# Altium project PRUEBA_1.PrjPcb
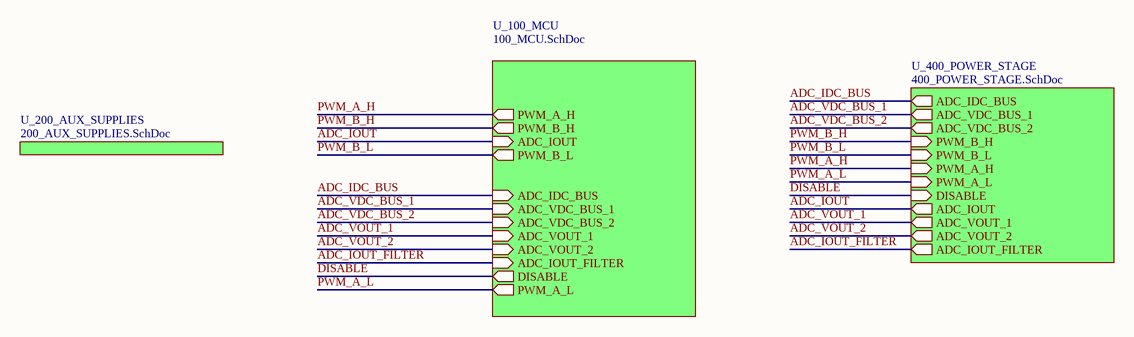
[diagram p0: 000_TOP.SchDoc]
5 sheets, 187 parts. Net scope: hierarchical (ports join the sheet entries above them; power ports are global).
Board file: PCB1.PcbDoc
Sheets:
  000_TOP.SchDoc
    U_200_AUX_SUPPLIES = 200_AUX_SUPPLIES.SchDoc
    U_400_POWER_STAGE = 400_POWER_STAGE.SchDoc
      H_BRIDGE_CORE = 410_H_BRIDGE_CORE.SchDoc
    U_100_MCU = 100_MCU.SchDoc

## Sheet 000_TOP.SchDoc
size Letter; SheetNumber: 1; SheetTotal: 5

### Sub-sheets
U_100_MCU = 100_MCU.SchDoc: PWM_A_H (out), PWM_B_H (out), ADC_IOUT (in), PWM_B_L (out), ADC_IDC_BUS (in), ADC_VDC_BUS_1 (in), ADC_VDC_BUS_2 (in), ADC_VOUT_1 (in), ADC_VOUT_2 (in), ADC_IOUT_FILTER (in), DISABLE (out), PWM_A_L (out)
U_200_AUX_SUPPLIES = 200_AUX_SUPPLIES.SchDoc: no entries
U_400_POWER_STAGE = 400_POWER_STAGE.SchDoc: ADC_IDC_BUS (out), ADC_VDC_BUS_1 (out), ADC_VDC_BUS_2 (out), PWM_B_H (in), PWM_B_L (in), PWM_A_H (in), PWM_A_L (in), DISABLE (in), ADC_IOUT (out), ADC_VOUT_1 (out), ADC_VOUT_2 (out), ADC_IOUT_FILTER (out)

### Nets
ADC_IDC_BUS: sheet U_400_POWER_STAGE/ADC_IDC_BUS, sheet U_100_MCU/ADC_IDC_BUS
ADC_IOUT: sheet U_400_POWER_STAGE/ADC_IOUT, sheet U_100_MCU/ADC_IOUT
ADC_IOUT_FILTER: sheet U_400_POWER_STAGE/ADC_IOUT_FILTER, sheet U_100_MCU/ADC_IOUT_FILTER
ADC_VDC_BUS_1: sheet U_400_POWER_STAGE/ADC_VDC_BUS_1, sheet U_100_MCU/ADC_VDC_BUS_1
ADC_VDC_BUS_2: sheet U_400_POWER_STAGE/ADC_VDC_BUS_2, sheet U_100_MCU/ADC_VDC_BUS_2
ADC_VOUT_1: sheet U_400_POWER_STAGE/ADC_VOUT_1, sheet U_100_MCU/ADC_VOUT_1
ADC_VOUT_2: sheet U_400_POWER_STAGE/ADC_VOUT_2, sheet U_100_MCU/ADC_VOUT_2
DISABLE: sheet U_400_POWER_STAGE/DISABLE, sheet U_100_MCU/DISABLE
PWM_A_H: sheet U_400_POWER_STAGE/PWM_A_H, sheet U_100_MCU/PWM_A_H
PWM_A_L: sheet U_400_POWER_STAGE/PWM_A_L, sheet U_100_MCU/PWM_A_L
PWM_B_H: sheet U_400_POWER_STAGE/PWM_B_H, sheet U_100_MCU/PWM_B_H
PWM_B_L: sheet U_400_POWER_STAGE/PWM_B_L, sheet U_100_MCU/PWM_B_L

## Sheet 200_AUX_SUPPLIES.SchDoc
size A3; SheetNumber: 3; SheetTotal: 5
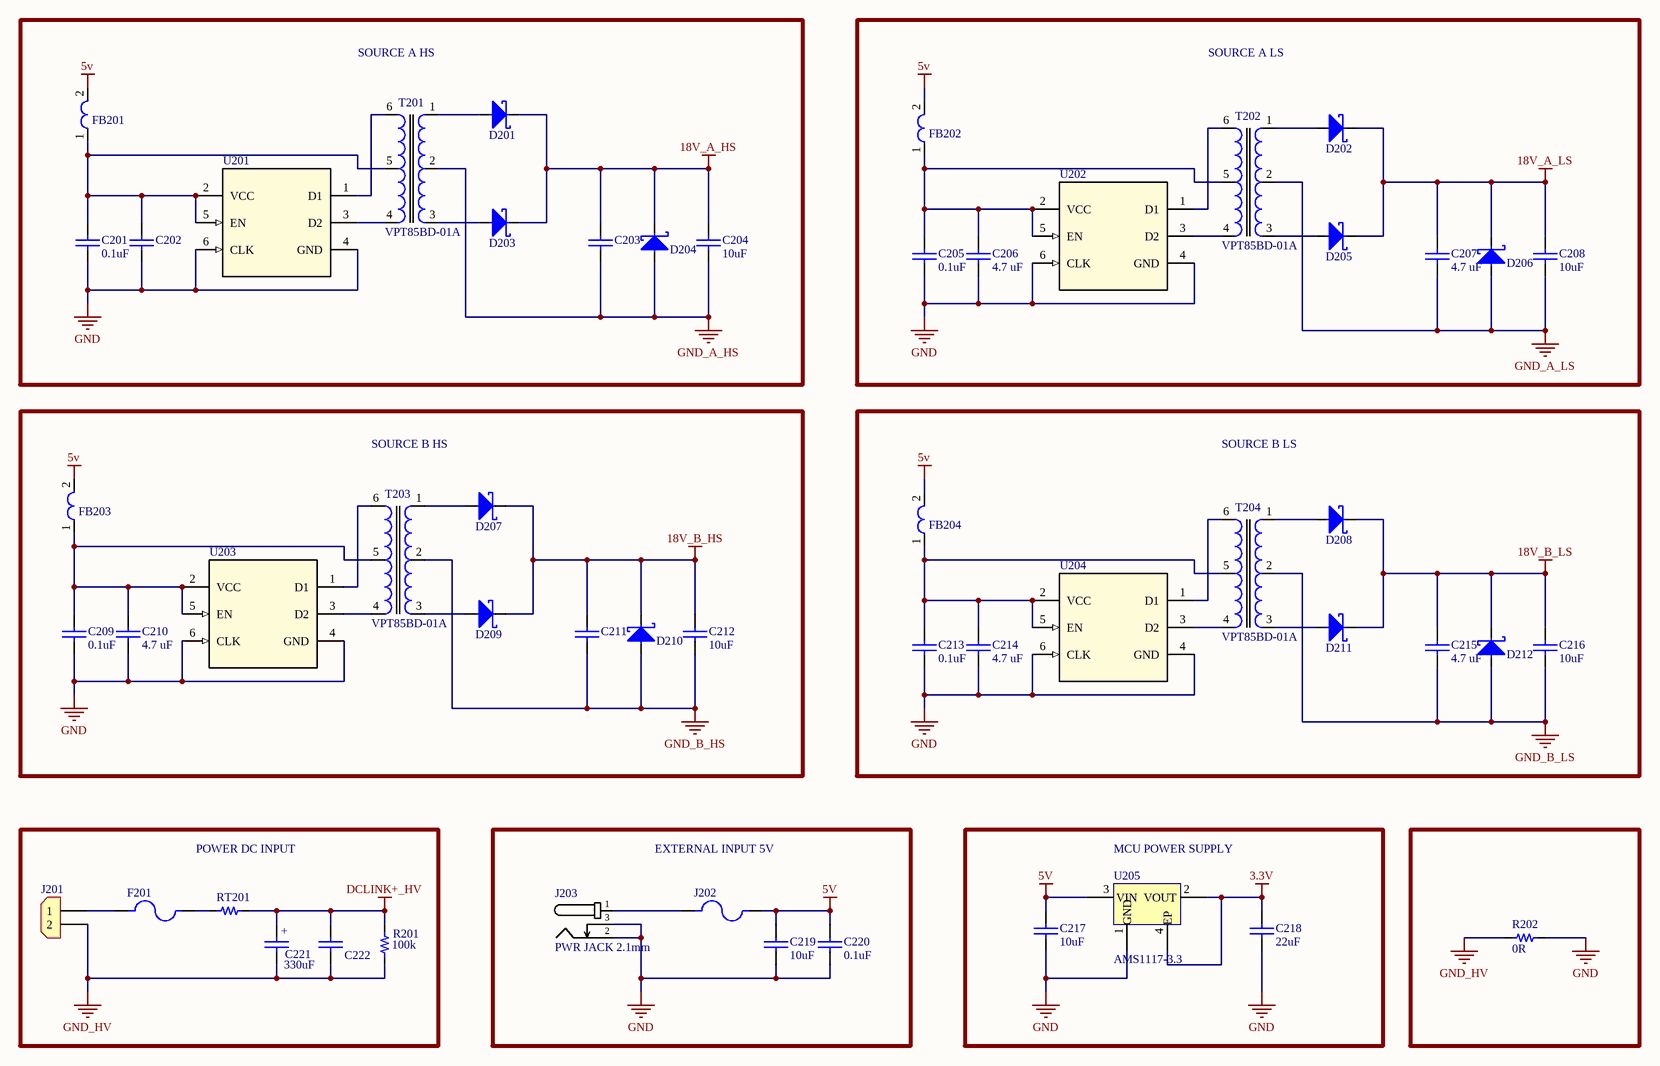
[diagram p1: 200_AUX_SUPPLIES.SchDoc]

### Parts
C201  value 0.1uF  [0603_cap]
C202  (no value)  [0603_cap]
C203  (no value)  [0603_cap]
C204  value 10uF  [0805_cap]
C205  value 0.1uF  [0603_cap]
C206  4.7 uF  [0603_cap]
C207  4.7 uF  [0603_cap]
C208  value 10uF  [0805_cap]
C209  value 0.1uF  [0603_cap]
C210  4.7 uF  [0603_cap]
C211  (no value)  [0603_cap]
C212  value 10uF  [0805_cap]
C213  value 0.1uF  [0603_cap]
C214  4.7 uF  [0603_cap]
C215  4.7 uF  [0603_cap]
C216  value 10uF  [0805_cap]
C217  value 10uF  [0603_cap]  (hidden comment: 10uF 10V)
C218  value 22uF  [0603_cap]  (hidden comment: 22uF 10V)
C219  value 10uF  [0805_cap]  (hidden comment: 10uF 25V)
C220  0.1uF  [0603_cap]
C221  value 330uF  [CAP_MXC_22x30_RUB]
C222  (no value)  [CAP_M26.5X8.5_22.5_1_KEM]
D201  30V 3A  [SMA]  (value not drawn)
D202  30V 3A  [SMA]  (value not drawn)
D203  30V 3A  [SMA]  (value not drawn)
D204  Diodo - Zener 20 V  [SOD-123_ONS]  (value not drawn)
D205  30V 3A  [SMA]  (value not drawn)
D206  Diodo - Zener 20 V  [SOD-123_ONS]  (value not drawn)
D207  30V 3A  [SMA]  (value not drawn)
D208  30V 3A  [SMA]  (value not drawn)
D209  30V 3A  [SMA]  (value not drawn)
D210  Diodo - Zener 20 V  [SOD-123_ONS]  (value not drawn)
D211  30V 3A  [SMA]  (value not drawn)
D212  Diodo - Zener 20 V  [SOD-123_ONS]  (value not drawn)
F201  (no value)  [FUSE_4628]
FB201  (no value)  [MH1608]
FB202  FERRITE_BEAD_600_OHM  [MH1608]  (value not drawn)
FB203  (no value)  [MH1608]
FB204  (no value)  [MH1608]
J201  (no value)  [CON_2x1_TH_5MM]
J202  FUSE HLDR CARTRIDGE 250V 5A PCB  [FUSE_4628]  (value not drawn)
J203  PWR JACK 2.1mm  [CON_POWER_BARREL_2.1MM_3CONN]
R201  value 100k  [YAG_FMP200_YAG]
R202  value 0R  [0603_res]  (hidden comment: 0R 1/10W)
RT201  (no value)  [RES_37S509M_TDK]
T201  Manufacturer Part Number: VPT85BD-01A  [PAD002-T764113S]  (hidden comment: TRANSFORMER_SMPS_XFMR_FWD)
T202  Manufacturer Part Number: VPT85BD-01A  [PAD002-T764113S]  (hidden comment: TRANSFORMER_SMPS_XFMR_FWD)
T203  Manufacturer Part Number: VPT85BD-01A  [PAD002-T764113S]  (hidden comment: TRANSFORMER_SMPS_XFMR_FWD)
T204  Manufacturer Part Number: VPT85BD-01A  [PAD002-T764113S]  (hidden comment: TRANSFORMER_SMPS_XFMR_FWD)
U201  (no value)  [IC TRANSFORMER DRIVER 6SOT-23]
U202  (no value)  [IC TRANSFORMER DRIVER 6SOT-23]
U203  (no value)  [IC TRANSFORMER DRIVER 6SOT-23]
U204  (no value)  [IC TRANSFORMER DRIVER 6SOT-23]
U205  AMS1117-3.3  [SOT_223]

### Blocks framed on the sheet
SOURCE A HS: C201-C204 D201 D203 D204 FB201 T201 U201
SOURCE A LS: C205-C208 D202 D205 D206 FB202 T202 U202
SOURCE B HS: C209-C212 D207 D209 D210 FB203 T203 U203
SOURCE B LS: C213-C216 D208 D211 D212 FB204 T204 U204
POWER DC INPUT: C221 C222 F201 J201 R201 RT201
EXTERNAL INPUT 5V: C219 C220 J202 J203
MCU POWER SUPPLY: C217 C218 U205

### Nets
3.3V: C218.1 U205.2(VOUT) U205.4(EP)
5v: C217.1 C219.1 C220.1 FB201.2 FB202.2 FB203.2 FB204.2 J202.2 U205.3(VIN)
18V_A_HS: C203.1 C204.1 D201.1 D203.1 D204.1
18V_A_LS: C207.1 C208.1 D202.1 D205.1 D206.1
18V_B_HS: C211.1 C212.1 D207.1 D209.1 D210.1
18V_B_LS: C215.1 C216.1 D208.1 D211.1 D212.1
DCLINK+_HV: C221.1 C222.1 R201.2 RT201.2
GND: C201.2 C202.2 C205.2 C206.2 C209.2 C210.2 C213.2 C214.2 C217.2 C218.2 C219.2 C220.2 J203.2 J203.3 R202.2 U201.4(GND) U201.6(CLK) U202.4(GND) U202.6(CLK) U203.4(GND) U203.6(CLK) U204.4(GND) U204.6(CLK) U205.1(GND)
GND_A_HS: C203.2 C204.2 D204.2 T201.2
GND_A_LS: C207.2 C208.2 D206.2 T202.2
GND_B_HS: C211.2 C212.2 D210.2 T203.2
GND_B_LS: C215.2 C216.2 D212.2 T204.2
GND_HV: C221.2 C222.2 J201.2 R201.1 R202.1
NetC201_1: C201.1 C202.1 FB201.1 T201.5 U201.2(VCC) U201.5(EN)
NetC205_1: C205.1 C206.1 FB202.1 T202.5 U202.2(VCC) U202.5(EN)
NetC209_1: C209.1 C210.1 FB203.1 T203.5 U203.2(VCC) U203.5(EN)
NetC213_1: C213.1 C214.1 FB204.1 T204.5 U204.2(VCC) U204.5(EN)
NetD201_2: D201.2 T201.1
NetD202_2: D202.2 T202.1
NetD203_2: D203.2 T201.3
NetD205_2: D205.2 T202.3
NetD207_2: D207.2 T203.1
NetD208_2: D208.2 T204.1
NetD209_2: D209.2 T203.3
NetD211_2: D211.2 T204.3
NetF201_1: F201.1 J201.1
NetF201_2: F201.2 RT201.1
NetJ202_1: J202.1 J203.1
NetT201_4: T201.4 U201.3(D2)
NetT201_6: T201.6 U201.1(D1)
NetT202_4: T202.4 U202.3(D2)
NetT202_6: T202.6 U202.1(D1)
NetT203_4: T203.4 U203.3(D2)
NetT203_6: T203.6 U203.1(D1)
NetT204_4: T204.4 U204.3(D2)
NetT204_6: T204.6 U204.1(D1)

### Notes on the sheet
- (in symbol CAP_ALUM_330UF_250V) +

### Library data of the parts
C201 C205 C209 C213 = Cap_0.1uF_0603_50V: 50V 100nF Y5V -20%~+80% 0603 Multilayer Ceramic Capacitors MLCC - SMD/SMT ROHS; Manufacturer: Walsin Tech Corp; Manufacturer Part Number: 0603F104Z500CT; Supplier 1: LCSC; Supplier Part Number 1: C83060; ComponentLink1Description: LCSC; ComponentLink1URL: https://www.lcsc.com/product-detail/Multilayer-Ceramic-Capacitors-MLCC-SMD-SMT_Walsin-Tech-Corp-0603F104Z500CT_C83060.html
C202 C203 C206 C207 C210 C211 C214 C215 = CAP_4.7UF_25V_0603: CAP CER 4.7uF 25V X5R 0603; Manufacturer: muRata; Manufacturer Part Number: GRM188R61E475KE11D; ComponentLink1Description: LCSC; ComponentLink1URL: https://www.lcsc.com/product-detail/C90057.html?s_z=n_q_GRM188R61E475KE11D&spm=wm.fly.bg.0.stp&lcsc_vid=RQNdVwAEE1JbUldTTgAIXlFWQ1NYXlYETgNXUlBVFQMxVlNRTlVXX11TRlZZXjsOAxUeFF5JWBYZEEoKFBINSQcJGk4%3D; Supplier 1: LCSC; Supplier Part Number 1: C90057
C204 C208 C212 C216 C219 = Cap_10uF_0805_25V_: 25V 10uF X5R ±10% 0805 Multilayer Ceramic Capacitors MLCC - SMD/SMT ROHS; Manufacturer: Samsung Electro-Mechanics; Manufacturer Part Number: CL21A106KAYNNNE; Supplier 1: LCSC; Supplier Part Number 1: C15850; ComponentLink1Description: LCSC; ComponentLink1URL: https://lcsc.com/product-detail/Multilayer-Ceramic-Capacitors-MLCC-SMD-SMT_Samsung-Electro-Mechanics-CL21A106KAYNNNE_C15850.html
C217 = Cap_10uF_0603_10V: 10V 10uF X5R ±10% 0603 Multilayer Ceramic Capacitors MLCC - SMD/SMT ROHS; Manufacturer: CCTC; Manufacturer Part Number: TCC0603X5R106K100CT; Supplier 1: LCSC; Supplier Part Number 1: C380314; ComponentLink1Description: LCSC; ComponentLink1URL: https://www.lcsc.com/product-detail/Multilayer-Ceramic-Capacitors-MLCC-SMD-SMT_CCTC-TCC0603X5R106K100CT_C380314.html
C218 = Cap_22uF_0603_10V: 10V 22uF X5R ±20% 0603 Multilayer Ceramic Capacitors MLCC - SMD/SMT ROHS; Manufacturer: HRE; Manufacturer Part Number: CGA0603X5R226M100JT; Supplier 1: LCSC; Supplier Part Number 1: C6119863; ComponentLink1Description: LCSC; ComponentLink1URL: https://lcsc.com/product-detail/Multilayer-Ceramic-Capacitors-MLCC-SMD-SMT_HRE-CGA0603X5R226M100JT_C6119863.html
C220 = Cap_0.1uF_0603_50V: CAP CER 100nF 50V Y5V 0603; Manufacturer: FOJAN; Manufacturer Part Number: FCC0603F104Z500CT; Supplier 1: LCSC; Supplier Part Number 1: C5137469; ComponentLink1Description: LCSC; ComponentLink1URL: https://www.lcsc.com/product-detail/C5137469.html?s_z=n_q_0603F104Z500CT&spm=wm.fly.bg.2.xh&lcsc_vid=Q1QLUFRRTgRfUVdSQAVWUgVQT1JdUlwFE1MMV1EEQgAxVlNRTlhfUFBXRlRXUTsOAxUeFF5JWBYZEEoKFBINSQcJGk4eFQsCAgIaSgADAwAHC0slTldfUldfWQkaCgg%3D; Value: 0.1uF
C221 = CAP_ALUM_330UF_250V: 330 µF 250 V Aluminum Electrolytic Capacitors Radial, Can - Snap-In 3000 Hrs @ 105°C; Manufacturer: Rubycon; Manufacturer Part Number: 250MXG330MEFCSN22X30; Supplier 1: LCSC; Supplier Part Number 1: C239294; ComponentLink1Description: LCSC; ComponentLink1URL: https://www.lcsc.com/product-detail/C239294.html?s_z=n_q_250MXG330MEFCSN22X30
C222 = CAP FILM 1UF 10% 400VDC RADIAL: 1 µF Film Capacitor 200V 400V Polyester, Polyethylene Terephthalate (PET), Metallized Radial; Manufacturer: KEMET; Manufacturer Part Number: R60MN4100AA40K; Supplier 1: LCSC; Supplier Part Number 1: C3775208; ComponentLink1Description: LCSC; ComponentLink1URL: https://www.lcsc.com/product-detail/C3775208.html?s_z=n_q_R60MN4100AA40K&spm=wm.fly.bg.0.xh&lcsc_vid=Q1QLUFRRTgRfUVdSQAVWUgVQT1JdUlwFE1MMV1EEQgAxVlNRTlZbUlJXT1VWXjsOAxUeFF5JWBYZEEoKFBINSQcJGk4eFQsCAgIaSgADAwAHC0slRVhXUFVQR08GEwkK
D201-D203 D205 D207-D209 D211 = D_Schottky_40V_3A_SMA: 40V Independent 3A 550mV@3A SMA Schottky Diodes ROHS; Manufacturer: TDSEMIC; Manufacturer Part Number: SS34-TD; Supplier 1: LCSC; Supplier Part Number 1: C46550832; ComponentLink1Description: LCSC; ComponentLink1URL: https://lcsc.com/product-detail/Schottky-Diodes_TDSEMIC-SS34-TD_C46550832.html
D204 D206 D210 D212 = Diodo - Zener 20 V: -55℃~+150℃ 1 Independent 100nA@15V 19V~21V 20V 25Ω 500mW 600Ω SOD-123 Zener Diodes ROHS; Manufacturer: Slkor(SLKORMICRO Elec.); Manufacturer Part Number: MMSZ5250B; Supplier 1: JLCPCB; Supplier Part Number 1: C707177; ComponentLink1Description: JLCPCB; ComponentLink1URL: https://jlcpcb.com/partdetail/Slkor_SLKORMICRO_Elec-MMSZ5250B/C707177
F201 J202 = FUSE HLDR CARTRIDGE 250V 5A PCB: Fuse Holder 5 A 250V 1 Circuit Cartridge Through Hole; Manufacturer: Keystone; Manufacturer Part Number: 4628; Supplier 1: LCSC; Supplier Part Number 1: C3205254; ComponentLink1Description: LCSC; ComponentLink1URL: https://www.lcsc.com/product-detail/C3205254.html?s_z=n_q_x_Keystone%25204628&spm=wm.ssy.em.0.tz&lcsc_vid=Q1QLUFRRTgRfUVdSQAVWUgVQT1JdUlwFE1MMV1EEQgAxVlNRTlZbVlFQQVlcXzsOAxUeFF5JWBYZEEoKFBINSQcJGk4eFQsCAgIaSgADAwAHC0slQ1hXVFRQQU8GEwkK
FB201-FB204 = FERRITE_BEAD_600_OHM: FERRITE BEAD 600 OHM 0603 4LN; Manufacturer: Bourns Inc.; Manufacturer Part Number: MH1608-601Y; ComponentLink1Description: DigiKEy; ComponentLink1URL: https://www.digikey.com/en/products/detail/bourns-inc/MH1608-601Y/2563317; Supplier 1: DigiKey; Supplier Part Number 1: MH1608-601YCT-ND
J201 = Con_2x1_TH_5mm: 2POS 5MM; Manufacturer: JILN; Manufacturer Part Number: JL126-50002G01; Supplier 1: LCSC; Supplier Part Number 1: C394556; ComponentLink1Description: Digi-Key; ComponentLink1URL: https://www.lcsc.com/product-detail/Screw-terminal_JILN-JL126-50002G01_C394556.html
J203 = Con_Power_Jack_2.1mm_3pins: CONN PWR JACK 2X5.5MM SOLDER; Manufacturer: HCTL; Manufacturer Part Number: HC-DC-005-2.0T; Supplier 1: LCSC; Supplier Part Number 1: C3010533; ComponentLink1Description: LCSC; ComponentLink1URL: https://www.lcsc.com/product-detail/AC-DC-Power-Connectors_HCTL-HC-DC-005-2-0T_C3010533.html
R201 = RES 100K OHM 5% 2W AXIAL: 100 kOhms ±5% 2W Through Hole Resistor Axial Flame Proof, Safety Metal Film; Manufacturer: YAGEO; Manufacturer Part Number: FMP200JR-52-100K; ComponentLink1URL: https://www.lcsc.com/product-detail/C3456483.html?s_z=n_q_FMP200JR-52-100K&spm=wm.fly.bg.0.xh&lcsc_vid=Q1QLUFRRTgRfUVdSQAVWUgVQT1JdUlwFE1MMV1EEQgAxVlNRTlZbUVVUQFBeVjsOAxUeFF5JWBYZEEoKFBINSQcJGk4eFQsCAgIaSgADAwAHC0slRFZZUlZWT08GEwkK; Supplier 1: LCSC; Supplier Part Number 1: C3456483; ComponentLink1Description: LCSC
R202 = Res_0R_0603_1/10W: RES SMD 0R OHM 5% 1/10W 0603; Manufacturer: FOJAN; Manufacturer Part Number: FRC0603P000 TS; ComponentLink1URL: https://www.lcsc.com/product-detail/Chip-Resistor-Surface-Mount_FOJAN-FRC0603P000-TS_C2907080.html; Supplier 1: LCSC; Supplier Part Number 1: C2907080; ComponentLink1Description: LCSC
RT201 = ICL_5_OHM_5A: Inrush Current Limiter 5 Ohms ±20% 5 A 0.591" (15.00mm); Manufacturer: TDK; Manufacturer Part Number: B57237S0509M000; ComponentLink1URL: https://www.lcsc.com/product-detail/C718537.html?s_z=n_q_B57237S0509M000&spm=wm.fly.bg.0.xh&lcsc_vid=FQVeX1BfQFIKVFVWE1NbBlcHQlcKVgFUQwMPAQZWElcxVlNRTlldUVVTT1FbVjsOAxUeFF5JWBYZEEoKFBINSQcJGk4eFQsCAgIaSgADAwAHC0slRFVbUVBeRE8GEwkK; Supplier 1: LCSC; Supplier Part Number 1: C718537; ComponentLink1Description: LCSC
T201-T204 = TRANSFORMER_SMPS_XFMR_FWD: XFMR FWD P-P DC/DC CONV 475UH SM; Manufacturer: VPSC; ComponentLink1Description: LCSC; ComponentLink1URL: https://www.lcsc.com/product-detail/C2846911.html; Supplier 1: LCSC; Supplier Part Number 1: C2846911
U201-U204 = IC_TRANSFORMER_DRIVER_6SOT-23: IC TRANSFORMER DRIVER 6SOT-23; Manufacturer Part Number: SN6505BDBVR; Manufacturer: Texas Instruments; ComponentLink1Description: LCSC; ComponentLink1URL: https://www.lcsc.com/product-detail/C74518.html?s_z=n_q_SN6505BDBVR&spm=wm.fly.bg.0.xh&lcsc_vid=RQNdVwAEE1JbUldTTgAIXlFWQ1NYXlYETgNXUlBVFQMxVlNRTlReV1VfRFJbUjsOAxUeFF5JWBYZEEoKFBINSQcJGk4eFQsCAgIaSgADAwAHC0slTlFeUlNIHxUDCw%3D%3D; Supplier 1: LCSC; Supplier Part Number 1: C74518
U205 = LDO_3V3_1A_FIXED: 1A 60dB@(120Hz) Fixed 3.3V Positive 18V SOT-223 Linear Voltage Regulators (LDO) ROHS; Manufacturer: UMW(Youtai Semiconductor Co., Ltd.); ComponentLink1Description: LCSC; ComponentLink1URL: https://www.lcsc.com/product-detail/_UMW-Youtai-Semiconductor-Co-Ltd-_C347222.html; Supplier 1: LCSC; Manufacturer Part Number: AMS1117-3.3; Supplier Part Number 1: C347222

## Sheet 400_POWER_STAGE.SchDoc
size A2; SheetNumber: 4; SheetTotal: 5
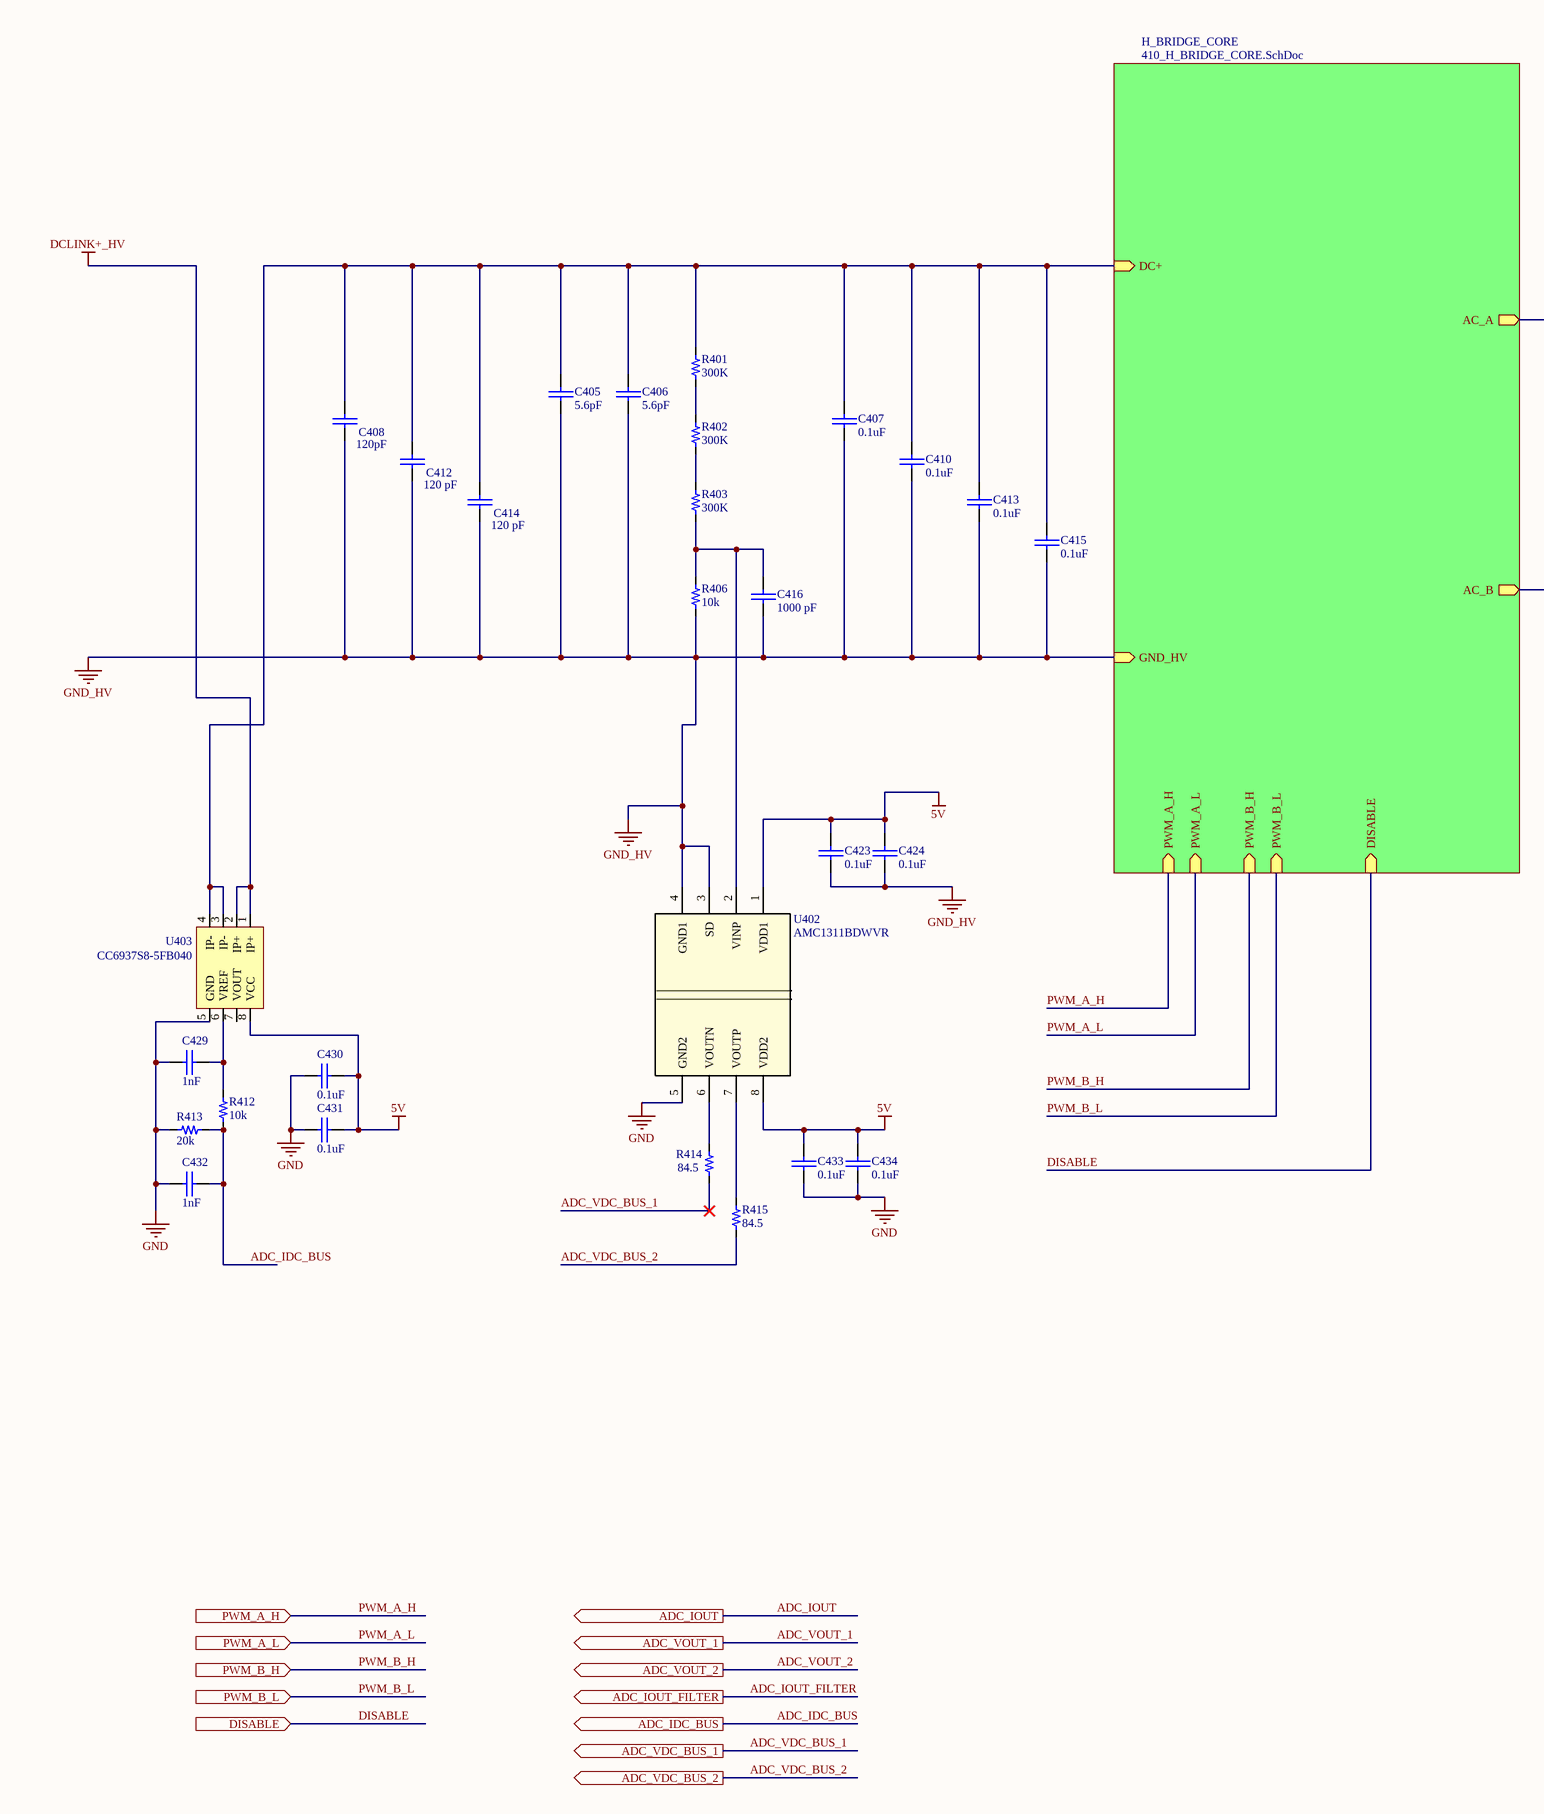
[diagram p2: 400_POWER_STAGE.SchDoc, left]
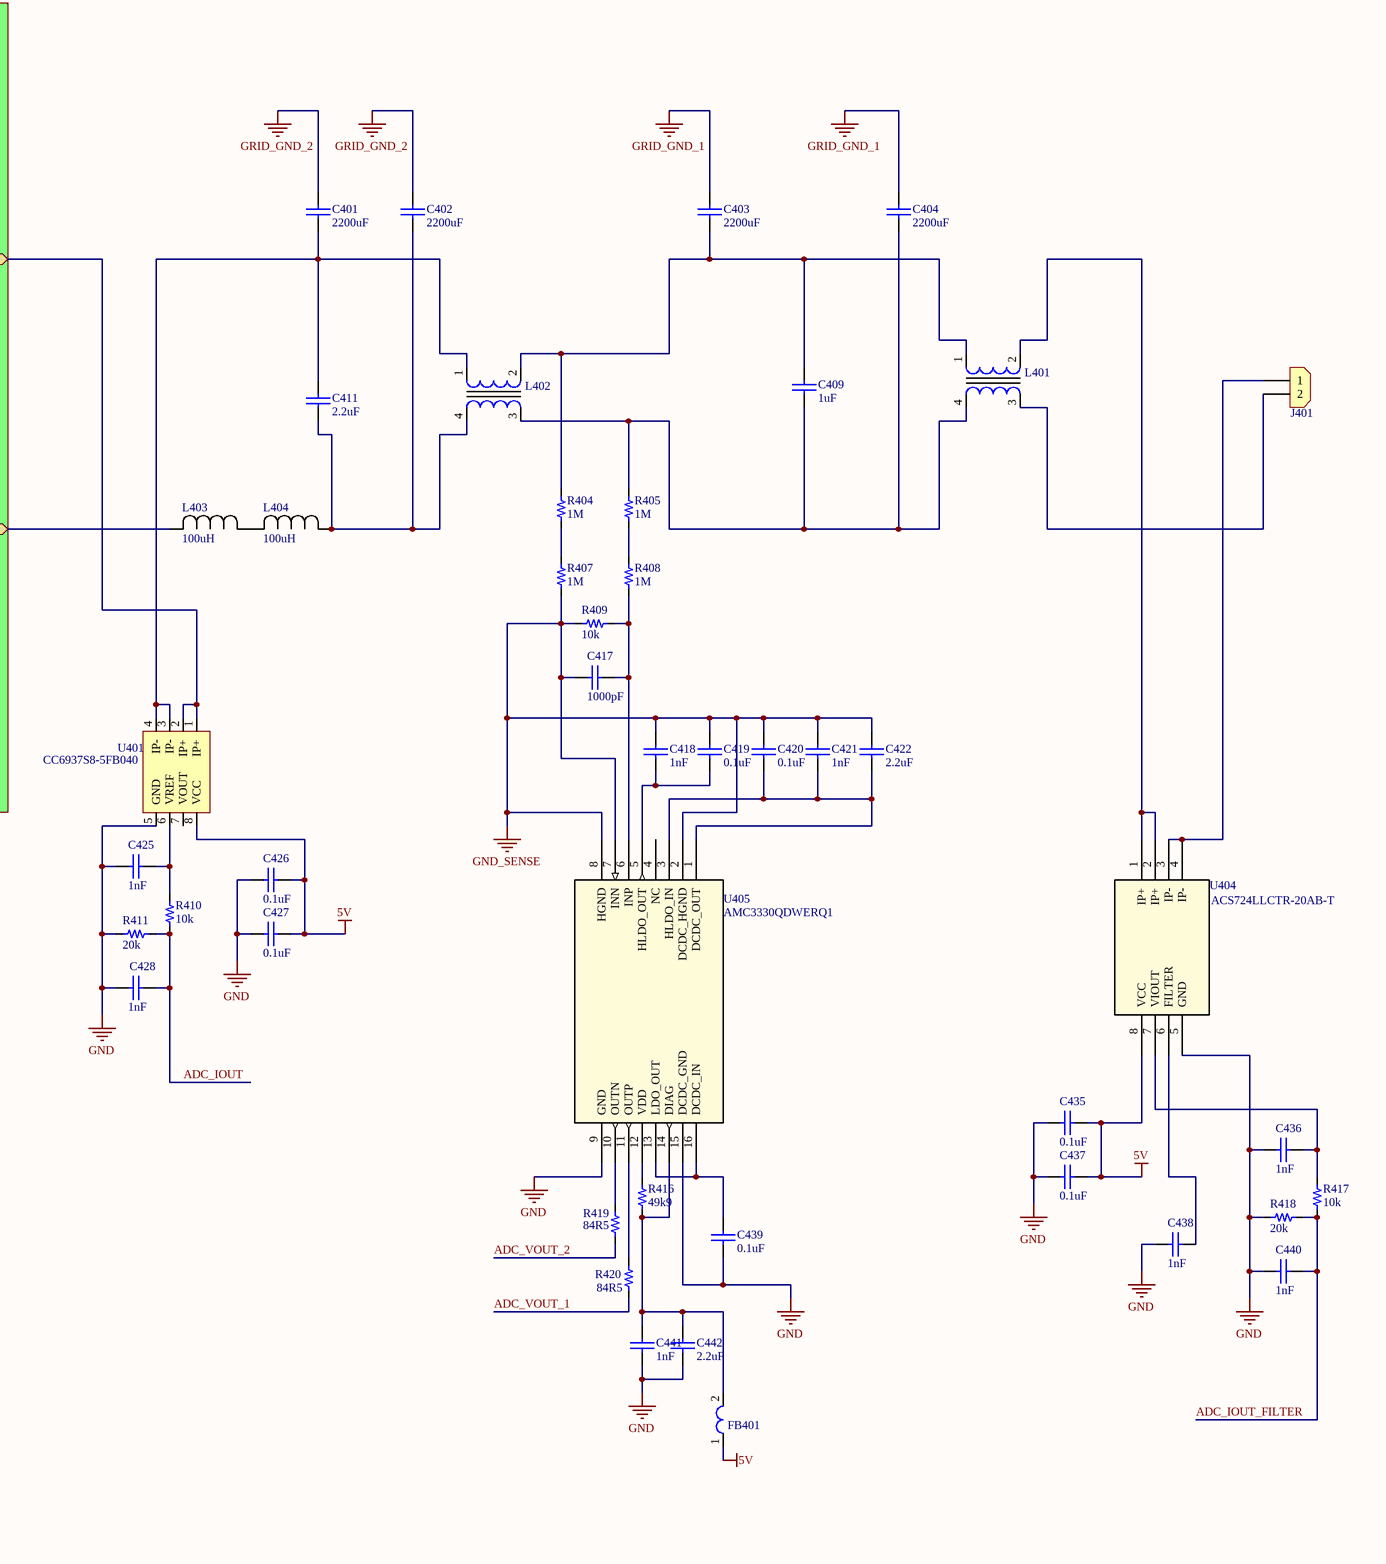
[diagram p3: 400_POWER_STAGE.SchDoc, right]

### Parts
C401  2200uF  [Through Hole,P=7.5mm]
C402  2200uF  [Through Hole,P=7.5mm]
C403  2200uF  [Through Hole,P=7.5mm]
C404  2200uF  [Through Hole,P=7.5mm]
C405  value 5.6pF  [0603_cap]  (hidden comment: 2.2uF)
C406  value 5.6pF  [0603_cap]  (hidden comment: 2.2uF)
C407  0.1uF  [0603_cap]
C408  120pF  [0603_cap]
C409  value 1uF  [CAP_2220]  (hidden comment: 1uF 50V)
C410  0.1uF  [0603_cap]
C411  value 2.2uF  [CAP_2220]
C412  120 pF  [0603_cap]
C413  0.1uF  [0603_cap]
C414  120 pF  [0603_cap]
C415  0.1uF  [0603_cap]
C416  1000 pF  [0603_cap]
C417  value 1000pF  [0603_cap]
C418  value 1nF  [0603_cap]
C419  0.1uF  [0603_cap]
C420  0.1uF  [0603_cap]
C421  value 1nF  [0603_cap]
C422  value 2.2uF  [0603_cap]
C423  0.1uF  [0603_cap]
C424  0.1uF  [0603_cap]
C425  value 1nF  [0603_cap]
C426  0.1uF  [0603_cap]
C427  0.1uF  [0603_cap]
C428  value 1nF  [0603_cap]
C429  value 1nF  [0603_cap]
C430  0.1uF  [0603_cap]
C431  0.1uF  [0603_cap]
C432  value 1nF  [0603_cap]
C433  0.1uF  [0603_cap]
C434  0.1uF  [0603_cap]
C435  0.1uF  [0603_cap]
C436  value 1nF  [0603_cap]
C437  0.1uF  [0603_cap]
C438  value 1nF  [0603_cap]
C439  0.1uF  [0603_cap]
C440  value 1nF  [0603_cap]
C441  value 1nF  [0603_cap]
C442  value 2.2uF  [0603_cap]
FB401  (no value)  [MH1608]
J401  (no value)  [CON_2x1_TH_5MM]
L401  (no value)  [PH9455405NL]
L402  (no value)  [PH9455405NL]
L403  value 100uH  [IND-SMD_L13.7-W12.8_FCH1365]  (hidden comment: 200uH)
L404  value 100uH  [IND-SMD_L13.7-W12.8_FCH1365]  (hidden comment: 200uH)
R401  300K  [0603_res]
R402  300K  [0603_res]
R403  300K  [0603_res]
R404  value 1M  [0603_res]
R405  value 1M  [0603_res]
R406  value 10k  [0603_res]
R407  value 1M  [0603_res]
R408  value 1M  [0603_res]
R409  value 10k  [0603_res]
R410  value 10k  [0603_res]
R411  20k  [0603_res]
R412  value 10k  [0603_res]
R413  20k  [0603_res]
R414  value 84.5  [0603_res]
R415  value 84.5  [0603_res]
R416  value 49k9  [0603_res]
R417  value 10k  [0603_res]
R418  20k  [0603_res]
R419  value 84R5  [0603_res]
R420  value 84R5  [0603_res]
U401  Manufacturer Part Number: CC6937S8-5FB040  [SOP-8_L4.9]
U402  AMC1311BDWVR  [DWV0008A]
U403  Manufacturer Part Number: CC6937S8-5FB040  [SOP-8_L4.9]
U404  Manufacturer Part Number: ACS724LLCTR-20AB-T  [SOICN8_LC_ALM]
U405  AMC3330QDWERQ1  [SOIC16_DWE_TEX]

### Sub-sheets
H_BRIDGE_CORE = 410_H_BRIDGE_CORE.SchDoc: PWM_A_H (in), PWM_A_L (in), PWM_B_H (in), PWM_B_L (in), DC+ (in), GND_HV (in), DISABLE (in), AC_A (out), AC_B (out)

### Ports
ADC_IDC_BUS (out), ADC_IOUT (out), ADC_IOUT_FILTER (out), ADC_VDC_BUS_1 (out), ADC_VDC_BUS_2 (out), ADC_VOUT_1 (out), ADC_VOUT_2 (out), DISABLE (in), PWM_A_H (in), PWM_A_L (in), PWM_B_H (in), PWM_B_L (in)

### Nets
5v: C423.1 C424.1 C426.2 C427.2 C430.2 C431.2 C433.1 C434.1 C435.2 C437.2 FB401.1 U401.8(VCC) U402.1(VDD1) U402.8(VDD2) U403.8(VCC) U404.8(VCC)
DCLINK+_HV: U403.1(IP+) U403.2(IP+)
GND: C425.2 C426.1 C427.1 C428.1 C429.2 C430.1 C431.1 C432.1 C433.2 C434.2 C435.1 C436.2 C437.1 C438.2 C439.2 C440.1 C441.2 C442.2 R411.1 R413.1 R418.1 U401.5(GND) U402.5(GND2) U403.5(GND) U404.5(GND) U405.9(GND) U405.15(DCDC_GND)
GND_HV: C405.2 C406.2 C407.2 C408.2 C410.2 C412.2 C413.2 C414.2 C415.2 C416.2 C423.2 C424.2 R406.1 U402.3(SD) U402.4(GND1) ; sheet H_BRIDGE_CORE/GND_HV
GND_SENSE: C417.1 C418.1 C419.1 C420.1 C421.1 C422.1 R407.1 R409.1 U405.2(DCDC_HGND) U405.7(INN) U405.8(HGND)
GRID_GND_1: C403.1 C404.1
GRID_GND_2: C401.1 C402.1
AC_A: U401.1(IP+) U401.2(IP+) ; sheet H_BRIDGE_CORE/AC_A
AC_B: L403.2 ; sheet H_BRIDGE_CORE/AC_B
ADC_IDC_BUS: C432.2 R412.1 R413.2 ; port ADC_IDC_BUS
ADC_IOUT: C428.2 R410.1 R411.2 ; port ADC_IOUT
ADC_IOUT_FILTER: C440.2 R417.1 R418.2 ; port ADC_IOUT_FILTER
ADC_VDC_BUS_1: R414.1 ; port ADC_VDC_BUS_1
ADC_VDC_BUS_2: R415.1 ; port ADC_VDC_BUS_2
ADC_VOUT_1: R420.1 ; port ADC_VOUT_1
ADC_VOUT_2: R419.1 ; port ADC_VOUT_2
DC+: C405.1 C406.1 C407.1 C408.1 C410.1 C412.1 C413.1 C414.1 C415.1 R401.2 U403.3(IP-) U403.4(IP-) ; sheet H_BRIDGE_CORE/DC+
DISABLE: port DISABLE, sheet H_BRIDGE_CORE/DISABLE
PWM_A_H: port PWM_A_H, sheet H_BRIDGE_CORE/PWM_A_H
PWM_A_L: port PWM_A_L, sheet H_BRIDGE_CORE/PWM_A_L
PWM_B_H: port PWM_B_H, sheet H_BRIDGE_CORE/PWM_B_H
PWM_B_L: port PWM_B_L, sheet H_BRIDGE_CORE/PWM_B_L
NetC401_2: C401.2 C411.2 L402.1 U401.3(IP-) U401.4(IP-)
NetC402_2: C402.2 C411.1 L402.4 L404.1
NetC403_2: C403.2 C409.1 L401.1 L402.2 R404.2
NetC404_2: C404.2 C409.2 L401.4 L402.3 R405.2
NetC416_1: C416.1 R403.1 R406.2 U402.2(VINP)
NetC417_2: C417.2 R408.1 R409.2 U405.6(INP)
NetC418_2: C418.2 C419.2 U405.5(HLDO_OUT)
NetC420_2: C420.2 C421.2 C422.2 U405.1(DCDC_OUT) U405.3(HLDO_IN)
NetC425_1: C425.1 R410.2 U401.6(VREF)
NetC429_1: C429.1 R412.2 U403.6(VREF)
NetC436_1: C436.1 R417.2 U404.7(VIOUT)
NetC438_1: C438.1 U404.6(FILTER)
NetC439_1: C439.1 U405.13(LDO_OUT) U405.16(DCDC_IN)
NetC441_1: C441.1 C442.1 FB401.2 R416.2 U405.14(DIAG)
NetJ401_1: J401.1 U404.3(IP-) U404.4(IP-)
NetJ401_2: J401.2 L401.3
NetL401_2: L401.2 U404.1(IP+) U404.2(IP+)
NetL403_1: L403.1 L404.2
NetR401_1: R401.1 R402.2
NetR402_1: R402.1 R403.2
NetR404_1: R404.1 R407.2
NetR405_1: R405.1 R408.2
NetR414_2: R414.2 U402.6(VOUTN)
NetR415_2: R415.2 U402.7(VOUTP)
NetR416_1: R416.1 U405.12(VDD)
NetR419_2: R419.2 U405.10(OUTN)
NetR420_2: R420.2 U405.11(OUTP)

Not connected (* = marked no-connect by the designer): U401 7(VOUT); U403 7(VOUT); U405 4(NC)

### Library data of the parts
C401-C404 = CAP_CER_2200PF_300VAC: 2200 pF ±20% 300VAC Ceramic Capacitor E Radial, Disc; Manufacturer: Murata Electronics; Manufacturer Part Number: DE6E3KJ222MN3A; Supplier 1: LCSC; Supplier Part Number 1: C710554; ComponentLink1Description: LCSC; ComponentLink1URL: https://www.lcsc.com/product-detail/C710554.html?s_z=n_q_DE6E3KJ222MN3A&spm=wm.fly.bg.0.xh&lcsc_vid=FQVeX1BfQFIKVFVWE1NbBlcHQlcKVgFUQwMPAQZWElcxVlNRTlheV1JTQ1JYVzsOAxUeFF5JWBYZEEoKFBINSQcJGk4eFQsCAgIaSgADAwAHC0slRVBYUFVUTk8GEwkK; Value: 2200uF
C405 C406 = CAP_CER_5.6pF_C0G_250V_0603: 5.6pF C0G 250V 0603 Ceramic Capacitors RoHS; Manufacturer: Taiyo Yuden; Manufacturer Part Number: VJ0603D5R6CXPAJ; Supplier 1: LCSC; Supplier Part Number 1: C2241545; ComponentLink1Description: LCSC; ComponentLink1URL: https://www.lcsc.com/product-detail/C337443.html?s_z=n_q_EMK107BB7225KA-T&spm=wm.fly.bg.0.xh&lcsc_vid=FQVeX1BfQFIKVFVWE1NbBlcHQlcKVgFUQwMPAQZWElcxVlNRTlheVFNUQFFcXzsOAxUeFF5JWBYZEEoKFBINSQcJGk4eFQsCAgIaSgADAwAHC0slRldcVVFRWQkaCgg%3D
C407 C410 C413 C415 C419 C420 C423 C424 C426 C427 C430 C431 C433-C435 C437 C439 = Cap_0.1uF_0603_50V: as C220 on sheet 200_AUX_SUPPLIES; Supplier 1: LCSC; Supplier Part Number 1: C5137469; ComponentLink1Description: LCSC; ComponentLink1URL: https://www.lcsc.com/product-detail/C5137469.html?s_z=n_q_0603F104Z500CT&spm=wm.fly.bg.2.xh&lcsc_vid=Q1QLUFRRTgRfUVdSQAVWUgVQT1JdUlwFE1MMV1EEQgAxVlNRTlhfUFBXRlRXUTsOAxUeFF5JWBYZEEoKFBINSQcJGk4eFQsCAgIaSgADAwAHC0slTldfUldfWQkaCgg%3D; Value: 0.1uF
C408 C412 C414 = CAP_CER _120PF_250V_0603: 120 pF ±5% 250V Capacitores cerámicos C0G, NP0 0603 (1608 métrico); Manufacturer: YAGEO; Manufacturer Part Number: CL10B102KB8NNNC; Supplier 1: LCSC; Supplier Part Number 1: C3852667; ComponentLink1Description: LCSC; ComponentLink1URL: https://www.lcsc.com/product-detail/C3852667.html?s_z=n_q_CC0603JRNPOYBN121&spm=wm.fly.bg.0.xh&lcsc_vid=Q1QLUFRRTgRfUVdSQAVWUgVQT1JdUlwFE1MMV1EEQgAxVlNRTldaUVdSRlBeXjsOAxUeFF5JWBYZEEoKFBINSQcJGk4dAgUUFAk%3D
C409 = CAP CER 1uF 450V X7T 2220: Manufacturer: muRata; Manufacturer Part Number: GC355XD7LP105KX17L; Supplier 1: LCSC; Supplier Part Number 1: C5119323; ComponentLink1Description: LCSC; ComponentLink1URL: https://www.lcsc.com/product-detail/C5119323.html?s_z=n_q_t_ceramic%2520capacitor&spm=wm.fly.bg.0.xh___wm.ssy.tc.0.tz&lcsc_vid=Q1QLUFRRTgRfUVdSQAVWUgVQT1JdUlwFE1MMV1EEQgAxVlNRTlhcUlRSQVJdUzsOAxUeFF5JWBYZEEoKFBINSQcJGk4dAgUUFAk%3D
C411 = Cap_2.2uF_2220: CAP CER 2.2uF 250V X7R 2220; Manufacturer: CCTC; Manufacturer Part Number: 2220B225K251CT; Supplier 1: LCSC; Supplier Part Number 1: C3845592; ComponentLink1Description: LCSC; ComponentLink1URL: https://www.lcsc.com/product-detail/Multilayer-Ceramic-Capacitors-MLCC-SMD-SMT_CCTC-TCC0603X5R106K100CT_C380314.html
C416 = CAP_CER_1000PF_10V_X7R_0603: 1000 pF ±10% 10V Ceramic Capacitor X7R 0603 (1608 Metric); Manufacturer: Johanson Technology Inc.; Manufacturer Part Number: C0603C102K5RACTU; Supplier 1: LCSC; Supplier Part Number 1: C2167129; ComponentLink1Description: LCSC; ComponentLink1URL: https://www.lcsc.com/product-detail/C2167129.html?s_z=n_q_p_C0603C102K8RACTU&spm=wm.ssy.bg.0.xh&lcsc_vid=FQVeX1BfQFIKVFVWE1NbBlcHQlcKVgFUQwMPAQZWElcxVlNRTllaV1NURlFaVzsOAxUeFF5JWBYZEEoKFBINSQcJGk4eFQsCAgIaSgADAwAHC0slRlBaUVJRWQkaCgg%3D
C417 = CAP CER 1000pF 100V C0G 0603: CAP CER 1nF 100V C0G 0603; Manufacturer: muRata; Manufacturer Part Number: GRM1885C2A102JA01D; Supplier 1: LCSC; Supplier Part Number 1: C162257; ComponentLink1Description: LCSC; ComponentLink1URL: https://www.lcsc.com/product-detail/C162257.html?s_z=n_q_GRM1885C2A102JA01D&spm=wm.fly.bg.0.xh&lcsc_vid=FQVeX1BfQFIKVFVWE1NbBlcHQlcKVgFUQwMPAQZWElcxVlNRTlheVFZSTlJfXjsOAxUeFF5JWBYZEEoKFBINSQcJGk4%3D
C418 C421 C425 C428 C429 C432 C436 C438 C440 C441 = Cap_1nF_0603_50V: 50V 1nF X7R ±10% 0603 Multilayer Ceramic Capacitors MLCC - SMD/SMT ROHS; Manufacturer: YAGEO; Manufacturer Part Number: CC0603KRX7R9BB102; Supplier 1: LCSC; Supplier Part Number 1: C100040; ComponentLink1Description: LCSC; ComponentLink1URL: https://www.lcsc.com/product-detail/Multilayer-Ceramic-Capacitors-MLCC-SMD-SMT_YAGEO-CC0603KRX7R9BB102_C100040.html
C422 C442 = CAP CER 2.2uF 16V X7R 0603: Manufacturer: Taiyo Yuden; Manufacturer Part Number: EMK107BB7225KA-T; Supplier 1: LCSC; Supplier Part Number 1: C337443; ComponentLink1Description: LCSC; ComponentLink1URL: https://www.lcsc.com/product-detail/C337443.html?s_z=n_q_EMK107BB7225KA-T&spm=wm.fly.bg.0.xh&lcsc_vid=FQVeX1BfQFIKVFVWE1NbBlcHQlcKVgFUQwMPAQZWElcxVlNRTlheVFNUQFFcXzsOAxUeFF5JWBYZEEoKFBINSQcJGk4eFQsCAgIaSgADAwAHC0slRldcVVFRWQkaCgg%3D
FB401 = FERRITE_BEAD_600_OHM: as FB201 on sheet 200_AUX_SUPPLIES; ComponentLink1Description: DigiKEy; ComponentLink1URL: https://www.digikey.com/en/products/detail/bourns-inc/MH1608-601Y/2563317; Supplier 1: DigiKey; Supplier Part Number 1: MH1608-601YCT-ND
J401 = Con_2x1_TH_5mm: as J201 on sheet 200_AUX_SUPPLIES; Supplier 1: LCSC; Supplier Part Number 1: C394556; ComponentLink1Description: Digi-Key; ComponentLink1URL: https://www.lcsc.com/product-detail/Screw-terminal_JILN-JL126-50002G01_C394556.html
L401 L402 = CMC 4.5MH 12A 2LN 4.4 KOHM TH: 4.5 mH @ 4 MHz 2 Line Common Mode Choke Through Hole 4.4 kOhms @ 4 MHz 12A DCR 8.5mOhm; Manufacturer: WurthPULSE Elektronik; Manufacturer Part Number: PH9455.405NL; ComponentLink1Description: JLCPCB; ComponentLink1URL: https://www.lcsc.com/product-detail/C5718402.html; Supplier 1: JLCPCB; Supplier Part Number 1: C5718402
L403 L404 = FIXED_IND_100UH_3A_1: 200 µH Unshielded Drum Core, Wirewound Inductor 3 A 80mOhm Max Radial, Horizontal Cylinder (Open); Manufacturer: FANGCHENG; Manufacturer Part Number: FCH1365-101M; Supplier 1: LCSC; Supplier Part Number 1: C20415559; ComponentLink1Description: LCSC; ComponentLink1URL: https://www.lcsc.com/product-detail/C20415559.html?s_z=n_q_C20415559&globalKeyword=C20415559
R401-R403 = RES_300K_OHM_0603: 300 kOhms ±1% 0.1W, 1/10W Chip Resistor 0603 (1608 Metric) Moisture Resistant Thick Film; Manufacturer: YAGEO; Manufacturer Part Number: RC0603FR-07300KL; ComponentLink1URL: https://www.lcsc.com/product-detail/C114667.html?s_z=n_q_RC0603FR-07300KL&spm=wm.fly.bg.0.cbh&lcsc_vid=FQVeX1BfQFIKVFVWE1NbBlcHQlcKVgFUQwMPAQZWElcxVlNRTlldX1NfRlVdUjsOAxUeFF5JWBYZEEoKFBINSQcJGk4eFQsCAgIaSgADAwAHC0slQFBWUldRWQkaCgg%3D; Supplier 1: LCSC; Supplier Part Number 1: C114667; ComponentLink1Description: LCSC
R404 R405 R407 R408 = RES_SMD_1M_OHM_0603: 1 MOhms ±1% 0.125W, 1/8W Chip Resistor 0603 (1608 Metric) Automotive AEC-Q200 Thick Film; Manufacturer: Vishay Dale; Manufacturer Part Number: CRCW06031M00FKEA; ComponentLink1URL: https://www.lcsc.com/product-detail/C844922.html?s_z=n_q_CRCW06031M00FKEA&spm=wm.fly.bg.0.xh&lcsc_vid=FQVeX1BfQFIKVFVWE1NbBlcHQlcKVgFUQwMPAQZWElcxVlNRTlheVV1VQVNXVDsOAxUeFF5JWBYZEEoKFBINSQcJGk4dAgUUFAk%3D; Supplier 1: LCSC; Supplier Part Number 1: C844922; ComponentLink1Description: LCSC
R406 R409 R410 R412 R417 = Res_10k_0603_1/10W: RES SMD 10k OHM 5% 1/10W 0603; Manufacturer: FOJAN; Manufacturer Part Number: FRC0603J103TS; ComponentLink1URL: https://www.lcsc.com/product-detail/Chip-Resistor-Surface-Mount_FOJAN-FRC0603J103TS_C2930027.html; Supplier 1: LCSC; Supplier Part Number 1: C2930027; ComponentLink1Description: LCSC
R411 R413 R418 = RES_20K_OHM_0603: RES 20kΩ ±1% 100mW 0603; Manufacturer: FOJAN; Manufacturer Part Number: FRC0603F2002TS; ComponentLink1URL: https://www.lcsc.com/product-detail/C2907011.html?s_z=n_q_t_resistor%252020k&spm=wm.fly.bg.0.xh___wm.ssy.tc.0.tz&lcsc_vid=Q1QLUFRRTgRfUVdSQAVWUgVQT1JdUlwFE1MMV1EEQgAxVlNRTlhfXldRRFJaUDsOAxUeFF5JWBYZEEoKFBINSQcJGk4dAgUUFAk%3D; Supplier 1: LCSC; Supplier Part Number 1: C2907011; ComponentLink1Description: LCSC; Value: 20k
R414 R415 R419 R420 = Res_84R5_0603_1/10W: 100mW Thick Film Resistor 50V ±100ppm/℃ ±1% 84.5Ω 0603 Chip Resistor - Surface Mount ROHS; Manufacturer: LIZ Elec; Manufacturer Part Number: CR0603FA84R5G; ComponentLink1URL: https://lcsc.com/product-detail/Chip-Resistor-Surface-Mount_LIZ-Elec-CR0603FA84R5G_C101216.html; Supplier 1: LCSC; Supplier Part Number 1: C101216; ComponentLink1Description: LCSC
R416 = Res_49k9_0603_1/10W: 100mW Thick Film Resistor 75V ±100ppm/℃ ±1% 49.9kΩ 0603 Chip Resistor - Surface Mount ROHS; Manufacturer: YAGEO; Manufacturer Part Number: RC0603FR-0749K9L; ComponentLink1URL: https://lcsc.com/product-detail/Chip-Resistor-Surface-Mount_YAGEO-RC0603FR-0749K9L_C114624.html; Supplier 1: LCSC; Supplier Part Number 1: C114624; ComponentLink1Description: LCSC
U401 U403 = Cross chip CC6937S8-5FB040: High-performance Hall effect current sensor; Manufacturer: Cross chip; Supplier 1: LCSC; Supplier Part Number 1: C41421928; ComponentLink1Description: LCSC; ComponentLink1URL: https://www.lcsc.com/product-detail/C41421928.html?s_z=n_q_CC6937S8-5FB040&spm=wm.fly.bg.0.xh&lcsc_vid=Q1QLUFRRTgRfUVdSQAVWUgVQT1JdUlwFE1MMV1EEQgAxVlNRTldbV1ZWRVhcVTsOAxUeFF5JWBYZEEoKFBINSQcJGk4eFQsCAgIaSgADAwAHC0slRVlYVFZWTk8GEwkK
U402 = IC ISOLATION 8SOIC: Aislamiento CI 8-SOIC; Manufacturer: Texas Instruments; ComponentLink1Description: LCSC; ComponentLink1URL: https://www.lcsc.com/product-detail/C783598.html?s_z=n_q_AMC1311BDWVR&spm=wm.fly.bg.0.xh&lcsc_vid=Q1QLUFRRTgRfUVdSQAVWUgVQT1JdUlwFE1MMV1EEQgAxVlNRTlRXVFRQRFNYXjsOAxUeFF5JWBYZEEoKFBINSQcJGk4eFQsCAgIaSgADAwAHC0slRlNXXlBRWQkaCgg%3D; Supplier 1: LCSC; Manufacturer Part Number: AMC1311BDWVR; Supplier Part Number 1: C783598
U404 = CURRENT SENSOR 20A: Sensores de corriente ±20 A 1 canal Efecto Hall, Circuito abierto Bidireccional 8-SOIC (0.154", 3.90mm de ancho); Manufacturer: Allegro MicroSystems; ComponentLink1Description: LCSC; ComponentLink1URL: https://www.lcsc.com/product-detail/Current-Sensors_Allegro-MicroSystems-LLC-ACS724LLCTR-20AB-T_C99738.html; Supplier 1: LCSC; Supplier Part Number 1: C99738
U405 = IC ISOLATED AMPLIFIER: Precision, ±1V input, enhanced isolation amplifier with integrated DC/DC converter; Manufacturer: Texas Instruments; ComponentLink1Description: LCSC; ComponentLink1URL: https://www.lcsc.com/product-detail/C5214212.html?s_z=n_q_AMC3330QDWERQ1&spm=wm.fly.bg.0.xh&lcsc_vid=Q1QLUFRRTgRfUVdSQAVWUgVQT1JdUlwFE1MMV1EEQgAxVlNRTlRXU1ReRFBfUjsOAxUeFF5JWBYZEEoKFBINSQcJGk4dAgUUFAk%3D; Supplier 1: LCSC; Manufacturer Part Number: AMC3330QDWERQ1; Supplier Part Number 1: C5214212

## Sheet 410_H_BRIDGE_CORE.SchDoc
size A2; SheetNumber: 5; SheetTotal: 5
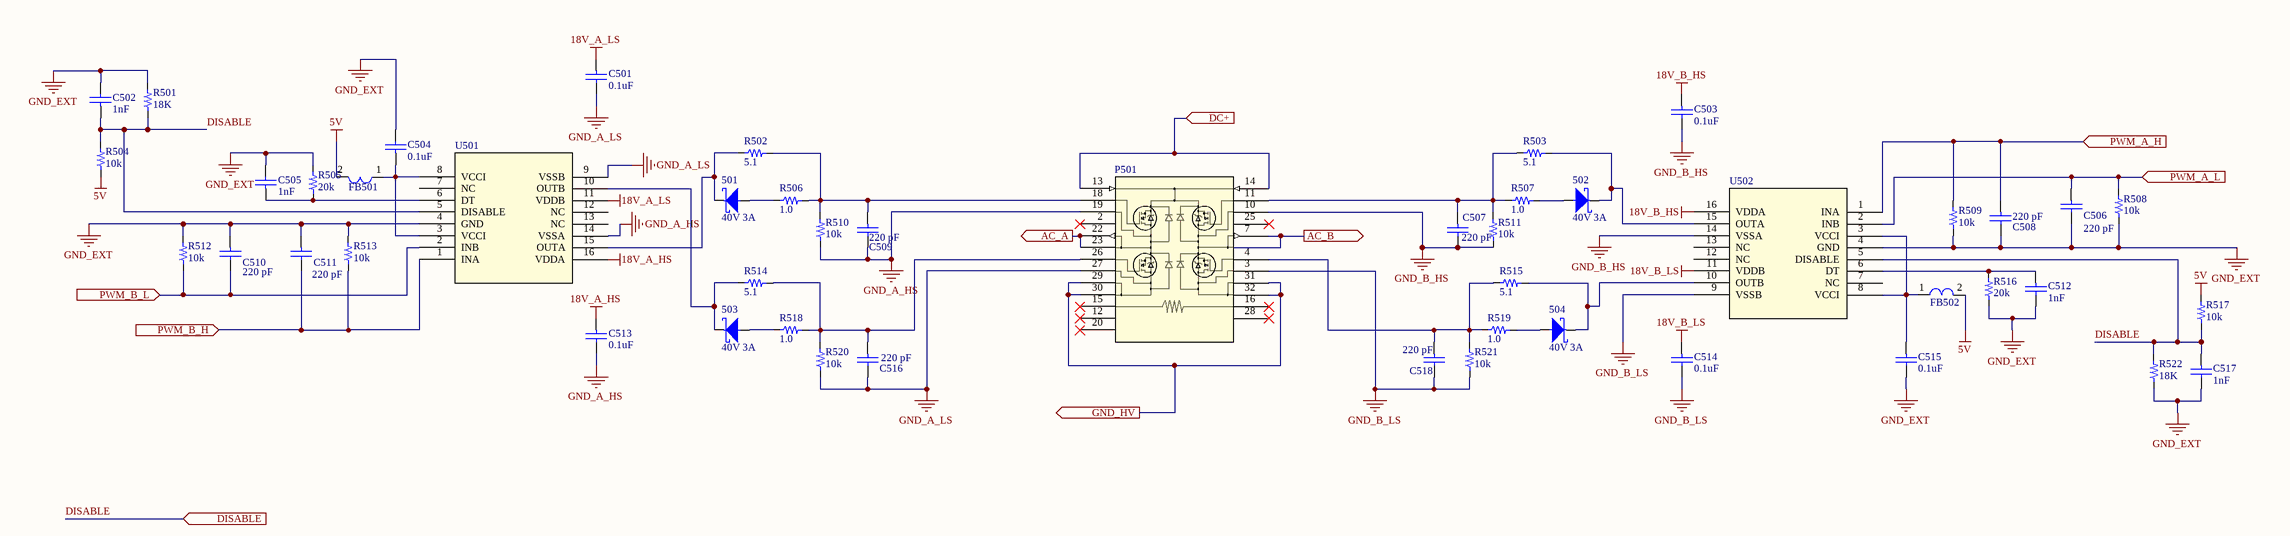
[diagram p4: 410_H_BRIDGE_CORE.SchDoc]

### Parts
501  40V 3A  [SMA]
502  40V 3A  [SMA]
503  40V 3A  [SMA]
504  40V 3A  [SMA]
C501  value 0.1uF  [0603_cap]
C502  value 1nF  [0603_cap]
C503  0.1uF  [0603_cap]
C504  value 0.1uF  [0603_cap]
C505  value 1nF  [0603_cap]
C506  220 pF  [0603_cap]
C507  220 pF  [0603_cap]
C508  220 pF  [0603_cap]
C509  220 pF  [0603_cap]
C510  220 pF  [0603_cap]
C511  220 pF  [0603_cap]
C512  value 1nF  [0603_cap]
C513  value 0.1uF  [0603_cap]
C514  value 0.1uF  [0603_cap]
C515  value 0.1uF  [0603_cap]
C516  220 pF  [0603_cap]
C517  value 1nF  [0603_cap]  (hidden comment: 1nF 50V)
C518  220 pF  [0603_cap]
FB501  (no value)  [MH1608]
FB502  (no value)  [MH1608]
P501  (no value)  [SP3F_MCH]
R501  18K  [0603_res]
R502  value 5.1  [0603_res]
R503  value 5.1  [0603_res]
R504  value 10k  [0603_res]
R505  20k  [0603_res]
R506  1.0  [0603_res]
R507  1.0  [0603_res]
R508  value 10k  [0603_res]
R509  value 10k  [0603_res]
R510  value 10k  [0603_res]
R511  value 10k  [0603_res]
R512  value 10k  [0603_res]
R513  value 10k  [0603_res]
R514  value 5.1  [0603_res]
R515  value 5.1  [0603_res]
R516  20k  [0603_res]
R517  value 10k  [0603_res]
R518  1.0  [0603_res]
R519  1.0  [0603_res]
R520  value 10k  [0603_res]
R521  value 10k  [0603_res]
R522  18K  [0603_res]
U501  (no value)  [UCC21540DW]
U502  (no value)  [UCC21540DW]

### Ports
AC_A (out), AC_B (out), DC+ (in), DISABLE (in), GND_HV (out), PWM_A_H (in), PWM_A_L (in), PWM_B_H (in), PWM_B_L (in)

### Nets
5v: FB501.2 FB502.2 R504.1 R517.2
18V_A_HS: C513.1 U501.16(VDDA)
18V_A_LS: C501.1 U501.11(VDDB)
18V_B_HS: C503.1 U502.16(VDDA)
18V_B_LS: C514.1 U502.11(VDDB)
GND_A_HS: C509.2 C513.2 P501.19 R510.1 U501.14(VSSA)
GND_A_LS: C501.2 C516.2 P501.27 R520.1 U501.9(VSSB)
GND_B_HS: C503.2 C507.2 P501.10 R511.1 U502.14(VSSA)
GND_B_LS: C514.2 C518.2 P501.3 R521.1 U502.9(VSSB)
GND_EXT: C502.2 C504.2 C505.2 C506.2 C508.2 C510.1 C511.1 C512.2 C515.2 C517.2 R501.2 R505.2 R508.1 R509.1 R512.2 R513.2 R516.1 R522.1 U501.4(GND) U502.4(GND)
GND_HV: P501.29 P501.30 P501.31 P501.32 ; port GND_HV
AC_A: P501.22 P501.23 ; port AC_A
AC_B: P501.7 ; port AC_B
DC+: P501.13 P501.14 ; port DC+
DISABLE: C502.1 C517.1 R501.1 R504.2 R517.1 R522.2 U501.5(DISABLE) U502.5(DISABLE) ; port DISABLE
PWM_A_H: C508.1 R509.2 U502.1(INA) ; port PWM_A_H
PWM_A_L: C506.1 R508.2 U502.2(INB) ; port PWM_A_L
PWM_B_H: C511.2 R513.1 U501.1(INA) ; port PWM_B_H
PWM_B_L: C510.2 R512.1 U501.2(INB) ; port PWM_B_L
Net501_1: 501.1 R502.1 U501.15(OUTA)
Net501_2: 501.2 R506.1
Net502_1: 502.1 R503.2 U502.15(OUTA)
Net502_2: 502.2 R507.2
Net503_1: 503.1 R514.1 U501.10(OUTB)
Net503_2: 503.2 R518.1
Net504_1: 504.1 R515.2 U502.10(OUTB)
Net504_2: 504.2 R519.2
NetC504_1: C504.1 FB501.1 U501.3(VCCI) U501.8(VCCI)
NetC505_1: C505.1 R505.1 U501.6(DT)
NetC507_1: C507.1 P501.11 R503.1 R507.1 R511.2
NetC509_1: C509.1 P501.18 R502.2 R506.2 R510.2
NetC512_1: C512.1 R516.2 U502.6(DT)
NetC515_1: C515.1 FB502.1 U502.3(VCCI) U502.8(VCCI)
NetC516_1: C516.1 P501.26 R514.2 R518.2 R520.2
NetC518_1: C518.1 P501.4 R515.1 R519.1 R521.2

Not connected (* = marked no-connect by the designer): P501 2* 12* 15* 16* 20* 25* 28*; U501 7(NC) 12(NC) 13(NC); U502 7(NC) 12(NC) 13(NC)

### Library data of the parts
501-504 = D_Schottky_40V_3A_SMA: as D201 on sheet 200_AUX_SUPPLIES; Supplier 1: LCSC; Supplier Part Number 1: C46550832; ComponentLink1Description: LCSC; ComponentLink1URL: https://lcsc.com/product-detail/Schottky-Diodes_TDSEMIC-SS34-TD_C46550832.html
C501 C504 C513-C515 = Cap_0.1uF_0603_50V: as C201 on sheet 200_AUX_SUPPLIES; Supplier 1: LCSC; Supplier Part Number 1: C83060; ComponentLink1Description: LCSC; ComponentLink1URL: https://www.lcsc.com/product-detail/Multilayer-Ceramic-Capacitors-MLCC-SMD-SMT_Walsin-Tech-Corp-0603F104Z500CT_C83060.html
C502 C505 C512 C517 = Cap_1nF_0603_50V: as C418 on sheet 400_POWER_STAGE; Supplier 1: LCSC; Supplier Part Number 1: C100040; ComponentLink1Description: LCSC; ComponentLink1URL: https://www.lcsc.com/product-detail/Multilayer-Ceramic-Capacitors-MLCC-SMD-SMT_YAGEO-CC0603KRX7R9BB102_C100040.html
C503 = Cap_0.1uF_0603_50V: as C220 on sheet 200_AUX_SUPPLIES; Supplier 1: LCSC; Supplier Part Number 1: C5137469; ComponentLink1Description: LCSC; ComponentLink1URL: https://www.lcsc.com/product-detail/C5137469.html?s_z=n_q_0603F104Z500CT&spm=wm.fly.bg.2.xh&lcsc_vid=Q1QLUFRRTgRfUVdSQAVWUgVQT1JdUlwFE1MMV1EEQgAxVlNRTlhfUFBXRlRXUTsOAxUeFF5JWBYZEEoKFBINSQcJGk4eFQsCAgIaSgADAwAHC0slTldfUldfWQkaCgg%3D; Value: 0.1uF
C506-C511 C516 C518 = CAP CER_220PF_50V_X7R_0603: CAP CER 220pF 50V X7R 0603; Manufacturer: Samsung Electro-Mechanics; Manufacturer Part Number: CL10B221KB8NNNC; Supplier 1: LCSC; Supplier Part Number 1: C1603; ComponentLink1Description: LCSC; ComponentLink1URL: https://www.lcsc.com/product-detail/C1603.html?spm=wm.fly.bg.0.xh&lcsc_vid=Q1QLUFRRTgRfUVdSQAVWUgVQT1JdUlwFE1MMV1EEQgAxVlNRTlhfUFFeRFBfXjsOAxUeFF5JWBYZEEoKFBINSQcJGk4NBhADEA4cHktXRlVcSQwSGg0%3D
FB501 FB502 = FERRITE_BEAD_600_OHM: as FB201 on sheet 200_AUX_SUPPLIES; ComponentLink1Description: DigiKEy; ComponentLink1URL: https://www.digikey.com/en/products/detail/bourns-inc/MH1608-601Y/2563317; Supplier 1: DigiKey; Supplier Part Number 1: MH1608-601YCT-ND
P501 = MOSFET_4N-CH: MOSFET - Arreglos 1200V (1.2kV) 173H (Tc) 745W (Tc) Montaje de chasis SP3F; Manufacturer: Microchip Technology; Manufacturer Part Number: MSCSM120HM16CT3AG; ComponentLink1Description: JLCPCB; ComponentLink1URL: https://www.digikey.com/es/products/detail/microchip-technology/MSCSM120HM16CT3AG/12350281?s=N4IgTCBcDaILIGUDCC4EYwAYAS6BsSAKgMwCCA4iALoC%2BQA; Supplier 1: DigiKey; Supplier Part Number 1: 150-MSCSM120HM16CT3AG-ND
R501 R522 = RES_18K_OHM _0603: 18 kOhms ±5% 0.1W, 1/10W Resistencia en microprocesador 0603 (1608 métrico) Resistente a la humedad Película gruesa; Manufacturer: YAGEO; Manufacturer Part Number: RC0603JR-0718KL; ComponentLink1URL: https://www.lcsc.com/product-detail/C105575.html?s_z=n_q_RC0603FR-0720KL&spm=wm.fly.bg.0.xh&lcsc_vid=RQNdVwAEE1JbUldTTgAIXlFWQ1NYXlYETgNXUlBVFQMxVlNRTlReVV1VQVBaVDsOAxUeFF5JWBYZEEoKFBINSQcJGk4eFQsCAgIaSgADAwAHC0slRlBcVFRTWQkaCgg%3D; Supplier 1: LCSC; Supplier Part Number 1: C105575; ComponentLink1Description: LCSC
R502 R503 R514 R515 = RES_SMD_5.1_OHM_0603: 5.1 Ohms ±1% 0.125W, 1/8W Resistencia en microprocesador 0603 (1608 métrico) AEC-Q200 automotriz Película gruesa; Manufacturer: VISHAY; Manufacturer Part Number: CRCW06035R10FKEA; ComponentLink1URL: https://lcsc.com/product-detail/Chip-Resistor-Surface-Mount_YAGEO-RC0603FR-0754K9L_C185321.html; Supplier 1: LCSC; Supplier Part Number 1: C242492; ComponentLink1Description: LCSC
R504 R508-R513 R517 R520 R521 = Res_10k_0603_1/10W: as R406 on sheet 400_POWER_STAGE; ComponentLink1URL: https://www.lcsc.com/product-detail/Chip-Resistor-Surface-Mount_FOJAN-FRC0603J103TS_C2930027.html; Supplier 1: LCSC; Supplier Part Number 1: C2930027; ComponentLink1Description: LCSC
R505 R516 = RES_20K_OHM_0603: as R411 on sheet 400_POWER_STAGE; ComponentLink1URL: https://www.lcsc.com/product-detail/C2907011.html?s_z=n_q_t_resistor%252020k&spm=wm.fly.bg.0.xh___wm.ssy.tc.0.tz&lcsc_vid=Q1QLUFRRTgRfUVdSQAVWUgVQT1JdUlwFE1MMV1EEQgAxVlNRTlhfXldRRFJaUDsOAxUeFF5JWBYZEEoKFBINSQcJGk4dAgUUFAk%3D; Supplier 1: LCSC; Supplier Part Number 1: C2907011; ComponentLink1Description: LCSC; Value: 20k
R506 R507 R518 R519 = RES_1_OHM_0603: 1 Ohms ±1% 0.1W, 1/10W Resistencia en microprocesador 0603 (1608 métrico) Resistente a la humedad Película gruesa; Manufacturer: YAGEO; Manufacturer Part Number: RC0603FR-071RL; ComponentLink1URL: https://www.lcsc.com/product-detail/C112305.html?s_z=n_q_RC0603FR-071RL&spm=wm.fly.bg.0.xh&lcsc_vid=RQNdVwAEE1JbUldTTgAIXlFWQ1NYXlYETgNXUlBVFQMxVlNRTlReVVxSRVZcUDsOAxUeFF5JWBYZEEoKFBINSQcJGk4eFQsCAgIaSgADAwAHC0slRVVcU11UWQkaCgg%3D; Supplier 1: LCSC; Supplier Part Number 1: C112305; ComponentLink1Description: LCSC
U501 U502 = DGTL ISO 5.7KV 2CH GT DVR 16SOIC: 4A, 6A Controladores de compuerta Acoplamiento capacitivo 5700Vrms 2 canal 16-SOIC; Manufacturer: Texas Instruments; ComponentLink1Description: DigiKEy; ComponentLink1URL: https://www.digikey.com/es/products/detail/texas-instruments/UCC21540DW/9860890; Supplier 1: DigiKey; Supplier Part Number 1: 296-53088-ND; Manufacturer Part Number: UCC21540DW

## Sheet 100_MCU.SchDoc
size A4; SheetNumber: 2; SheetTotal: 5
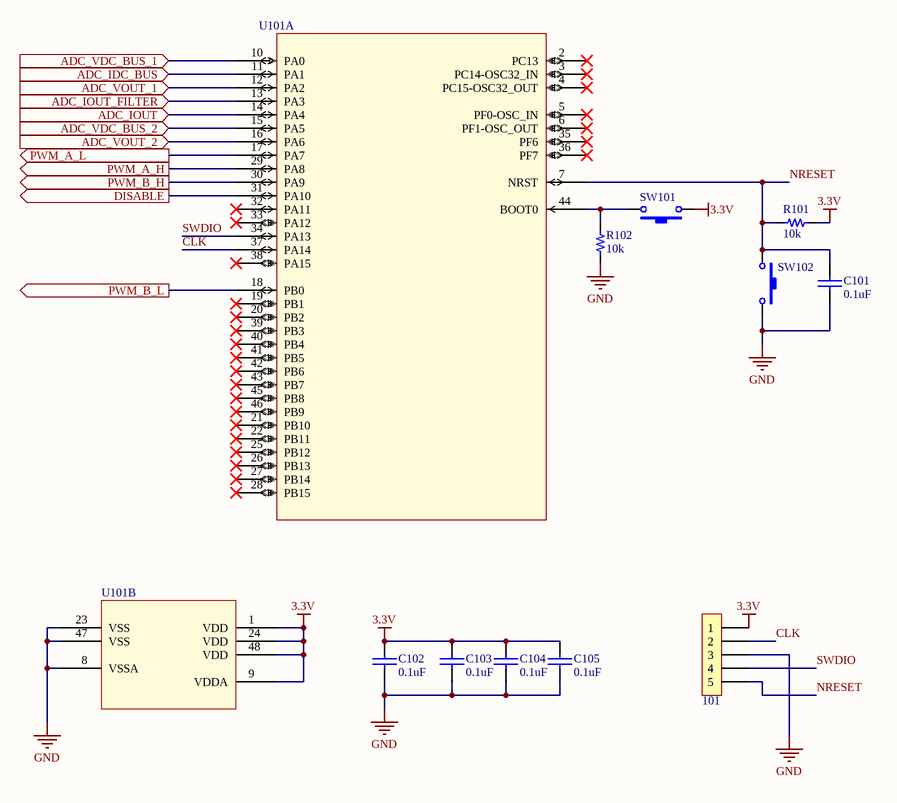
[diagram p5: 100_MCU.SchDoc]

### Parts
101  (no value)  [H_5x1_TH_100mil]  (no BOM)
C101  value 0.1uF  [0603_cap]
C102  0.1uF  [0603_cap]
C103  0.1uF  [0603_cap]
C104  0.1uF  [0603_cap]
C105  0.1uF  [0603_cap]
R101  value 10k  [0603_res]
R102  value 10k  [0603_res]  (hidden comment: 10k 1/10W)
SW101  (no value)  [Sw_PUSH_4.5x4.5x5mm]
SW102  (no value)  [Sw_PUSH_4.5x4.5x5mm]
U101  (no value)  [LQFP48_7x7mm]  (parts A,B of 2)

### Ports
ADC_IDC_BUS (in), ADC_IOUT (in), ADC_IOUT_FILTER (in), ADC_VDC_BUS_1 (in), ADC_VDC_BUS_2 (in), ADC_VOUT_1 (in), ADC_VOUT_2 (in), DISABLE (out), PWM_A_H (out), PWM_A_L (out), PWM_B_H (out), PWM_B_L (out)

### Nets
3.3V: 101.1 C102.1 C103.1 C104.1 C105.1 R101.2 SW101.1 U101.1(VDD) U101.9(VDDA) U101.24(VDD) U101.48(VDD)
GND: 101.3 C101.2 C102.2 C103.2 C104.2 C105.2 R102.1 SW102.2 U101.8(VSSA) U101.23(VSS) U101.47(VSS)
ADC_IDC_BUS: U101.11(PA1) ; port ADC_IDC_BUS
ADC_IOUT: U101.14(PA4) ; port ADC_IOUT
ADC_IOUT_FILTER: U101.13(PA3) ; port ADC_IOUT_FILTER
ADC_VDC_BUS_1: U101.10(PA0) ; port ADC_VDC_BUS_1
ADC_VDC_BUS_2: U101.15(PA5) ; port ADC_VDC_BUS_2
ADC_VOUT_1: U101.12(PA2) ; port ADC_VOUT_1
ADC_VOUT_2: U101.16(PA6) ; port ADC_VOUT_2
CLK: 101.2 U101.37(PA14)
DISABLE: U101.31(PA10) ; port DISABLE
NRESET: 101.5 C101.1 R101.1 SW102.1 U101.7(NRST)
PWM_A_H: U101.29(PA8) ; port PWM_A_H
PWM_A_L: U101.17(PA7) ; port PWM_A_L
PWM_B_H: U101.30(PA9) ; port PWM_B_H
PWM_B_L: U101.18(PB0) ; port PWM_B_L
SWDIO: 101.4 U101.34(PA13)
NetR102_2: R102.2 SW101.2 U101.44(BOOT0)

Not connected (* = marked no-connect by the designer): U101 2(PC13)* 3(PC14-OSC32_IN)* 4(PC15-OSC32_OUT)* 5(PF0-OSC_IN)* 6(PF1-OSC_OUT)* 19(PB1)* 20(PB2)* 21(PB10)* 22(PB11)* 25(PB12)* 26(PB13)* 27(PB14)* 28(PB15)* 32(PA11)* 33(PA12)* 35(PF6)* 36(PF7)* 38(PA15)* 39(PB3)* 40(PB4)* 41(PB5)* 42(PB6)* 43(PB7)* 45(PB8)* 46(PB9)*

### Library data of the parts
101 = H_Male_5x1_TH_100mil: ComponentLink1Description: LCSC
C101 = Cap_0.1uF_0603_50V: as C201 on sheet 200_AUX_SUPPLIES; Supplier 1: LCSC; Supplier Part Number 1: C83060; ComponentLink1Description: LCSC; ComponentLink1URL: https://www.lcsc.com/product-detail/Multilayer-Ceramic-Capacitors-MLCC-SMD-SMT_Walsin-Tech-Corp-0603F104Z500CT_C83060.html
C102-C105 = Cap_0.1uF_0603_50V: as C220 on sheet 200_AUX_SUPPLIES; Supplier 1: LCSC; Supplier Part Number 1: C5137469; ComponentLink1Description: LCSC; ComponentLink1URL: https://www.lcsc.com/product-detail/C5137469.html?s_z=n_q_0603F104Z500CT&spm=wm.fly.bg.2.xh&lcsc_vid=Q1QLUFRRTgRfUVdSQAVWUgVQT1JdUlwFE1MMV1EEQgAxVlNRTlhfUFBXRlRXUTsOAxUeFF5JWBYZEEoKFBINSQcJGk4eFQsCAgIaSgADAwAHC0slTldfUldfWQkaCgg%3D; Value: 0.1uF
R101 R102 = Res_10k_0603_1/10W: as R406 on sheet 400_POWER_STAGE; ComponentLink1URL: https://www.lcsc.com/product-detail/Chip-Resistor-Surface-Mount_FOJAN-FRC0603J103TS_C2930027.html; Supplier 1: LCSC; Supplier Part Number 1: C2930027; ComponentLink1Description: LCSC
SW101 SW102 = Sw_PUSH_4.5x4.5x5.0xmm: SWITCH TACTILE SPST-NO 0.05A 12V; Manufacturer: BZCN; Manufacturer Part Number: TSC015A05026A; Supplier 1: LCSC; Supplier Part Number 1: C2888509; Last modified by: N-A.Potosi; Last modified date: 20190222; ComponentLink1Description: LCSC; ComponentLink1URL: https://www.lcsc.com/product-detail/Tactile-Switches_BZCN-TSC015A05026A_C2888509.html
U101 = IC_STM32F030C8T6TR_LQFP48_7x7MM: IC MCU 32BIT 64KB FLASH 48LQFP; Manufacturer: STMicroelectronics; Manufacturer part number: STM32F030C8T6TR; Supplier 1: LCSC; Supplier Part Number 1: C23922; ComponentLink1Description: LCSC; ComponentLink1URL: https://www.lcsc.com/product-detail/ST-Microelectronics_STMicroelectronics-STM32F030C8T6_C23922.html

## Nets that join several sheets
3.3V: 200_AUX_SUPPLIES (C218.1 U205.2 U205.4), 100_MCU (11 pins)
5v: 200_AUX_SUPPLIES (9 pins), 400_POWER_STAGE (16 pins), 410_H_BRIDGE_CORE (FB501.2 FB502.2 R504.1 R517.2)
18V_A_HS: 200_AUX_SUPPLIES (5 pins), 410_H_BRIDGE_CORE (C513.1 U501.16)
18V_A_LS: 200_AUX_SUPPLIES (5 pins), 410_H_BRIDGE_CORE (C501.1 U501.11)
18V_B_HS: 200_AUX_SUPPLIES (5 pins), 410_H_BRIDGE_CORE (C503.1 U502.16)
18V_B_LS: 200_AUX_SUPPLIES (5 pins), 410_H_BRIDGE_CORE (C514.1 U502.11)
DCLINK+_HV: 200_AUX_SUPPLIES (C221.1 C222.1 R201.2 RT201.2), 400_POWER_STAGE (U403.1 U403.2)
GND: 200_AUX_SUPPLIES (24 pins), 400_POWER_STAGE (27 pins), 100_MCU (11 pins)
GND_A_HS: 200_AUX_SUPPLIES (C203.2 C204.2 D204.2 T201.2), 410_H_BRIDGE_CORE (5 pins)
GND_A_LS: 200_AUX_SUPPLIES (C207.2 C208.2 D206.2 T202.2), 410_H_BRIDGE_CORE (5 pins)
GND_B_HS: 200_AUX_SUPPLIES (C211.2 C212.2 D210.2 T203.2), 410_H_BRIDGE_CORE (5 pins)
GND_B_LS: 200_AUX_SUPPLIES (C215.2 C216.2 D212.2 T204.2), 410_H_BRIDGE_CORE (5 pins)
GND_HV: 200_AUX_SUPPLIES (5 pins), 400_POWER_STAGE (15 pins), 410_H_BRIDGE_CORE (P501.29 P501.30 P501.31 P501.32)
AC_A: 400_POWER_STAGE (U401.1 U401.2), 410_H_BRIDGE_CORE (P501.22 P501.23)
AC_B: 400_POWER_STAGE (L403.2), 410_H_BRIDGE_CORE (P501.7)
ADC_IDC_BUS: 400_POWER_STAGE (C432.2 R412.1 R413.2), 100_MCU (U101.11)
ADC_IOUT: 400_POWER_STAGE (C428.2 R410.1 R411.2), 100_MCU (U101.14)
ADC_IOUT_FILTER: 400_POWER_STAGE (C440.2 R417.1 R418.2), 100_MCU (U101.13)
ADC_VDC_BUS_1: 400_POWER_STAGE (R414.1), 100_MCU (U101.10)
ADC_VDC_BUS_2: 400_POWER_STAGE (R415.1), 100_MCU (U101.15)
ADC_VOUT_1: 400_POWER_STAGE (R420.1), 100_MCU (U101.12)
ADC_VOUT_2: 400_POWER_STAGE (R419.1), 100_MCU (U101.16)
DC+: 400_POWER_STAGE (12 pins), 410_H_BRIDGE_CORE (P501.13 P501.14)
DISABLE: 410_H_BRIDGE_CORE (8 pins), 100_MCU (U101.31)
PWM_A_H: 410_H_BRIDGE_CORE (C508.1 R509.2 U502.1), 100_MCU (U101.29)
PWM_A_L: 410_H_BRIDGE_CORE (C506.1 R508.2 U502.2), 100_MCU (U101.17)
PWM_B_H: 410_H_BRIDGE_CORE (C511.2 R513.1 U501.1), 100_MCU (U101.30)
PWM_B_L: 410_H_BRIDGE_CORE (C510.2 R512.1 U501.2), 100_MCU (U101.18)